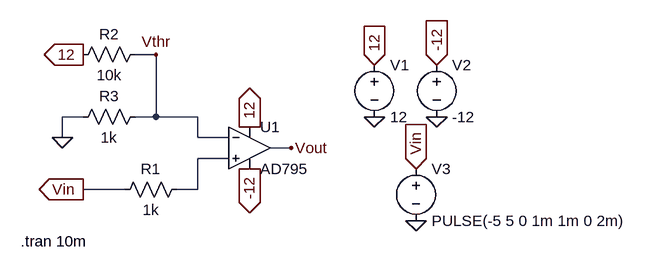
[diagram p0: schematic lab8.1.2.asc]
lab8.1.2.asc, the LTspice schematic file:
Version 4
SHEET 1 880 680
WIRE 16 -16 -16 -16
WIRE -96 80 -128 80
WIRE 16 80 16 -16
WIRE 16 80 -16 80
WIRE 80 80 16 80
WIRE -128 112 -128 80
WIRE 80 112 80 80
WIRE 128 112 80 112
WIRE 224 128 192 128
WIRE 128 144 80 144
WIRE -32 192 -96 192
WIRE 80 192 80 144
WIRE 80 192 48 192
FLAG 352 80 0
FLAG 448 80 0
FLAG 352 0 12
IOPIN 352 0 In
FLAG 448 0 -12
IOPIN 448 0 In
FLAG 16 -16 Vthr
FLAG -128 112 0
FLAG -96 -16 12
IOPIN -96 -16 Out
FLAG 416 160 Vin
IOPIN 416 160 In
FLAG -96 192 Vin
IOPIN -96 192 Out
FLAG 416 240 0
FLAG 224 128 Vout
FLAG 160 96 12
IOPIN 160 96 Out
FLAG 160 160 -12
IOPIN 160 160 Out
SYMBOL voltage 352 -16 R0
SYMATTR InstName V1
SYMATTR Value 12
SYMBOL voltage 448 -16 R0
SYMATTR InstName V2
SYMATTR Value -12
SYMBOL res 64 176 R90
WINDOW 0 0 56 VBottom 2
WINDOW 3 32 56 VTop 2
SYMATTR InstName R1
SYMATTR Value 1k
SYMBOL res 0 -32 R90
WINDOW 0 0 56 VBottom 2
WINDOW 3 32 56 VTop 2
SYMATTR InstName R2
SYMATTR Value 10k
SYMBOL res 0 64 R90
WINDOW 0 0 56 VBottom 2
WINDOW 3 32 56 VTop 2
SYMATTR InstName R3
SYMATTR Value 1k
SYMBOL voltage 416 144 R0
WINDOW 123 0 0 Left 0
WINDOW 39 0 0 Left 0
SYMATTR InstName V3
SYMATTR Value PULSE(-5 5 0 1m 1m 0 2m)
SYMBOL Opamps\\AD795 160 64 R0
SYMATTR InstName U1
TEXT -192 272 Left 2 !.tran 10m

The netlist it stands for:
* lab8.1.2.asc
V1 12 0 12
V2 -12 0 -12
R1 N001 Vin 1k
R2 Vthr 12 10k
R3 Vthr 0 1k
V3 Vin 0 PULSE(-5 5 0 1m 1m 0 2m)
XU1 N001 Vthr 12 -12 Vout AD795  ; pins In+ In- V+ V- OUT
.tran 10m
.lib ADI1.lib
.backanno
.end